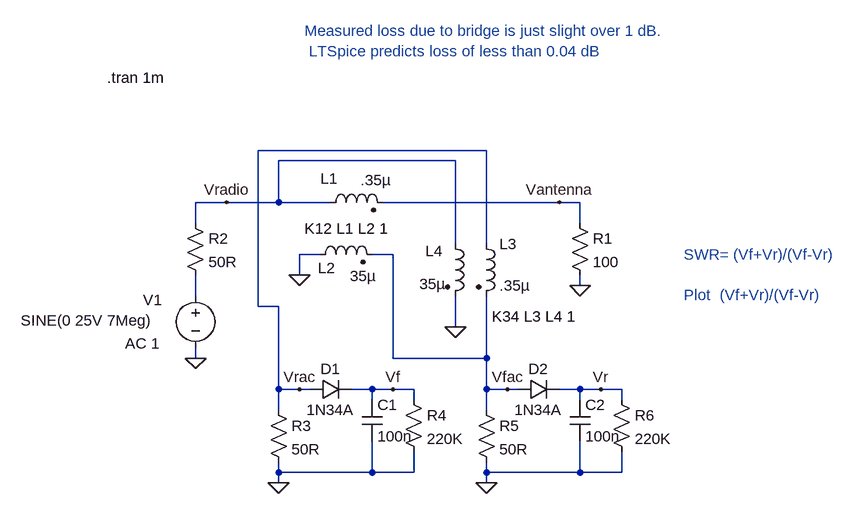
[diagram p0: schematic SWR Bridge.asc]
SWR Bridge.asc, the LTspice schematic file:
Version 4
SHEET 1 1100 680
WIRE 320 0 -32 0
WIRE 272 16 0 16
WIRE -80 80 -128 80
WIRE 0 80 0 16
WIRE 0 80 -80 80
WIRE 80 80 0 80
WIRE 432 80 160 80
WIRE 464 80 432 80
WIRE -128 112 -128 80
WIRE 464 112 464 80
WIRE 272 144 272 16
WIRE 320 144 320 0
WIRE 64 160 32 160
WIRE 176 160 144 160
WIRE 32 192 32 160
WIRE 464 208 464 192
WIRE -128 224 -128 192
WIRE -32 240 -32 0
WIRE 0 240 -32 240
WIRE 272 272 272 224
WIRE -128 320 -128 304
WIRE 176 320 176 160
WIRE 320 320 320 224
WIRE 320 320 176 320
WIRE 0 368 0 240
WIRE 32 368 0 368
WIRE 48 368 32 368
WIRE 144 368 112 368
WIRE 176 368 144 368
WIRE 208 368 176 368
WIRE 320 368 320 320
WIRE 352 368 320 368
WIRE 368 368 352 368
WIRE 464 368 432 368
WIRE 496 368 464 368
WIRE 528 368 496 368
WIRE 144 384 144 368
WIRE 208 384 208 368
WIRE 464 384 464 368
WIRE 528 384 528 368
WIRE 0 400 0 368
WIRE 320 400 320 368
WIRE 0 496 0 480
WIRE 144 496 144 448
WIRE 144 496 0 496
WIRE 208 496 208 464
WIRE 208 496 144 496
WIRE 320 496 320 480
WIRE 464 496 464 448
WIRE 464 496 320 496
WIRE 528 496 528 464
WIRE 528 496 464 496
WIRE 0 512 0 496
WIRE 320 512 320 496
FLAG 464 208 0
FLAG -128 320 0
FLAG 272 272 0
FLAG 32 192 0
FLAG 0 512 0
FLAG 320 512 0
FLAG 32 368 Vrac
FLAG 352 368 Vfac
FLAG 496 368 Vr
FLAG 176 368 Vf
FLAG -80 80 Vradio
FLAG 432 80 Vantenna
SYMBOL ind2 64 96 R270
WINDOW 0 37 14 VTop 2
WINDOW 3 66 86 VBottom 2
SYMATTR InstName L1
SYMATTR Value .35µ
SYMATTR Type ind
SYMBOL ind2 256 128 R0
WINDOW 0 -30 27 Left 2
WINDOW 3 -39 78 Left 2
SYMATTR InstName L4
SYMATTR Value 35µ
SYMATTR Type ind
SYMBOL res 448 96 R0
SYMATTR InstName R1
SYMATTR Value 100
SYMBOL voltage -128 208 R0
WINDOW 123 -108 89 Left 2
WINDOW 39 0 0 Left 2
WINDOW 0 -81 22 Left 2
WINDOW 3 -269 54 Left 2
SYMATTR Value2 AC 1
SYMATTR InstName V1
SYMATTR Value SINE(0 25V 7Meg)
SYMBOL res -144 96 R0
SYMATTR InstName R2
SYMATTR Value 50R
SYMBOL ind2 48 176 R270
WINDOW 0 -21 26 VTop 2
WINDOW 3 -2 82 VBottom 2
SYMATTR InstName L2
SYMATTR Value 35µ
SYMATTR Type ind
SYMBOL res -16 384 R0
SYMATTR InstName R3
SYMATTR Value 50R
SYMBOL diode 48 384 R270
WINDOW 0 32 32 VTop 2
WINDOW 3 0 32 VBottom 2
SYMATTR InstName D1
SYMATTR Value 1N34A
SYMBOL cap 128 384 R0
SYMATTR InstName C1
SYMATTR Value 100n
SYMBOL res 192 368 R0
SYMATTR InstName R4
SYMATTR Value 220K
SYMBOL ind2 304 128 R0
WINDOW 0 36 16 Left 2
SYMATTR InstName L3
SYMATTR Value .35µ
SYMATTR Type ind
SYMBOL res 304 384 R0
SYMATTR InstName R5
SYMATTR Value 50R
SYMBOL diode 368 384 R270
WINDOW 0 32 32 VTop 2
WINDOW 3 0 32 VBottom 2
SYMATTR InstName D2
SYMATTR Value 1N34A
SYMBOL cap 448 384 R0
SYMATTR InstName C2
SYMATTR Value 100n
SYMBOL res 512 368 R0
SYMATTR InstName R6
SYMATTR Value 220K
TEXT 40 120 Left 2 !K12 L1 L2 1
TEXT 328 256 Left 2 !K34 L3 L4 1
TEXT 624 160 Left 2 ;SWR= (Vf+Vr)/(Vf-Vr)\n \nPlot  (Vf+Vr)/(Vf-Vr)
TEXT -264 -112 Left 2 !.tran 1m
TEXT 40 -184 Left 2 ;Measured loss due to bridge is just slight over 1 dB. \n LTSpice predicts loss of less than 0.04 dB

The netlist it stands for:
* SWR Bridge.asc
L1 Vradio Vantenna .35µ
L4 Vradio 0 35µ
R1 Vantenna 0 100
V1 N001 0 SINE(0 25V 7Meg) AC 1
R2 Vradio N001 50R
L2 0 Vfac 35µ
R3 Vrac 0 50R
D1 Vrac Vf 1N34A
C1 Vf 0 100n
R4 Vf 0 220K
L3 Vrac Vfac .35µ
R5 Vfac 0 50R
D2 Vfac Vr 1N34A
C2 Vr 0 100n
R6 Vr 0 220K
.model D D
.lib standard.dio
K12 L1 L2 1
K34 L3 L4 1
* SWR= (Vf+Vr)/(Vf-Vr)
* Plot  (Vf+Vr)/(Vf-Vr)
.tran 1m
* Measured loss due to bridge is just slight over 1 dB.
*  LTSpice predicts loss of less than 0.04 dB
.backanno
.end